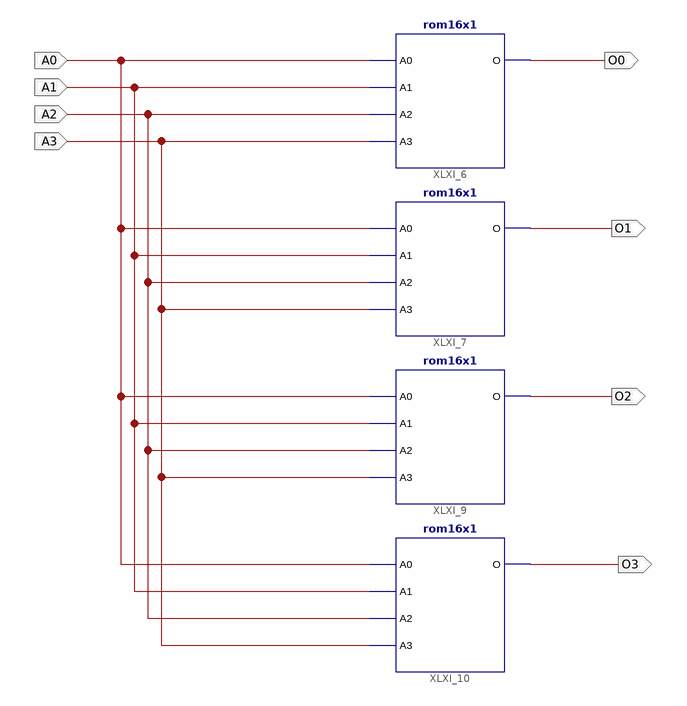
[diagram p0: schematic sheet 1]
// Xilinx ISE schematic lab2.sch (spartan3e) as structural Verilog: 4 symbols, 8 ports
module lab2 (
  input  A3,
  input  A0,
  input  A1,
  input  A2,
  output O3,
  output O2,
  output O1,
  output O0
);

  rom16x1 #(.INIT("00f6")) XLXI_6 (.A0(A0), .A1(A1), .A2(A2), .A3(A3), .O(O0));
  rom16x1 #(.INIT("005e")) XLXI_10 (.A0(A0), .A1(A1), .A2(A2), .A3(A3), .O(O3));
  rom16x1 #(.INIT("00ba")) XLXI_9 (.A0(A0), .A1(A1), .A2(A2), .A3(A3), .O(O2));
  rom16x1 #(.INIT("0027")) XLXI_7 (.A0(A0), .A1(A1), .A2(A2), .A3(A3), .O(O1));
endmodule
